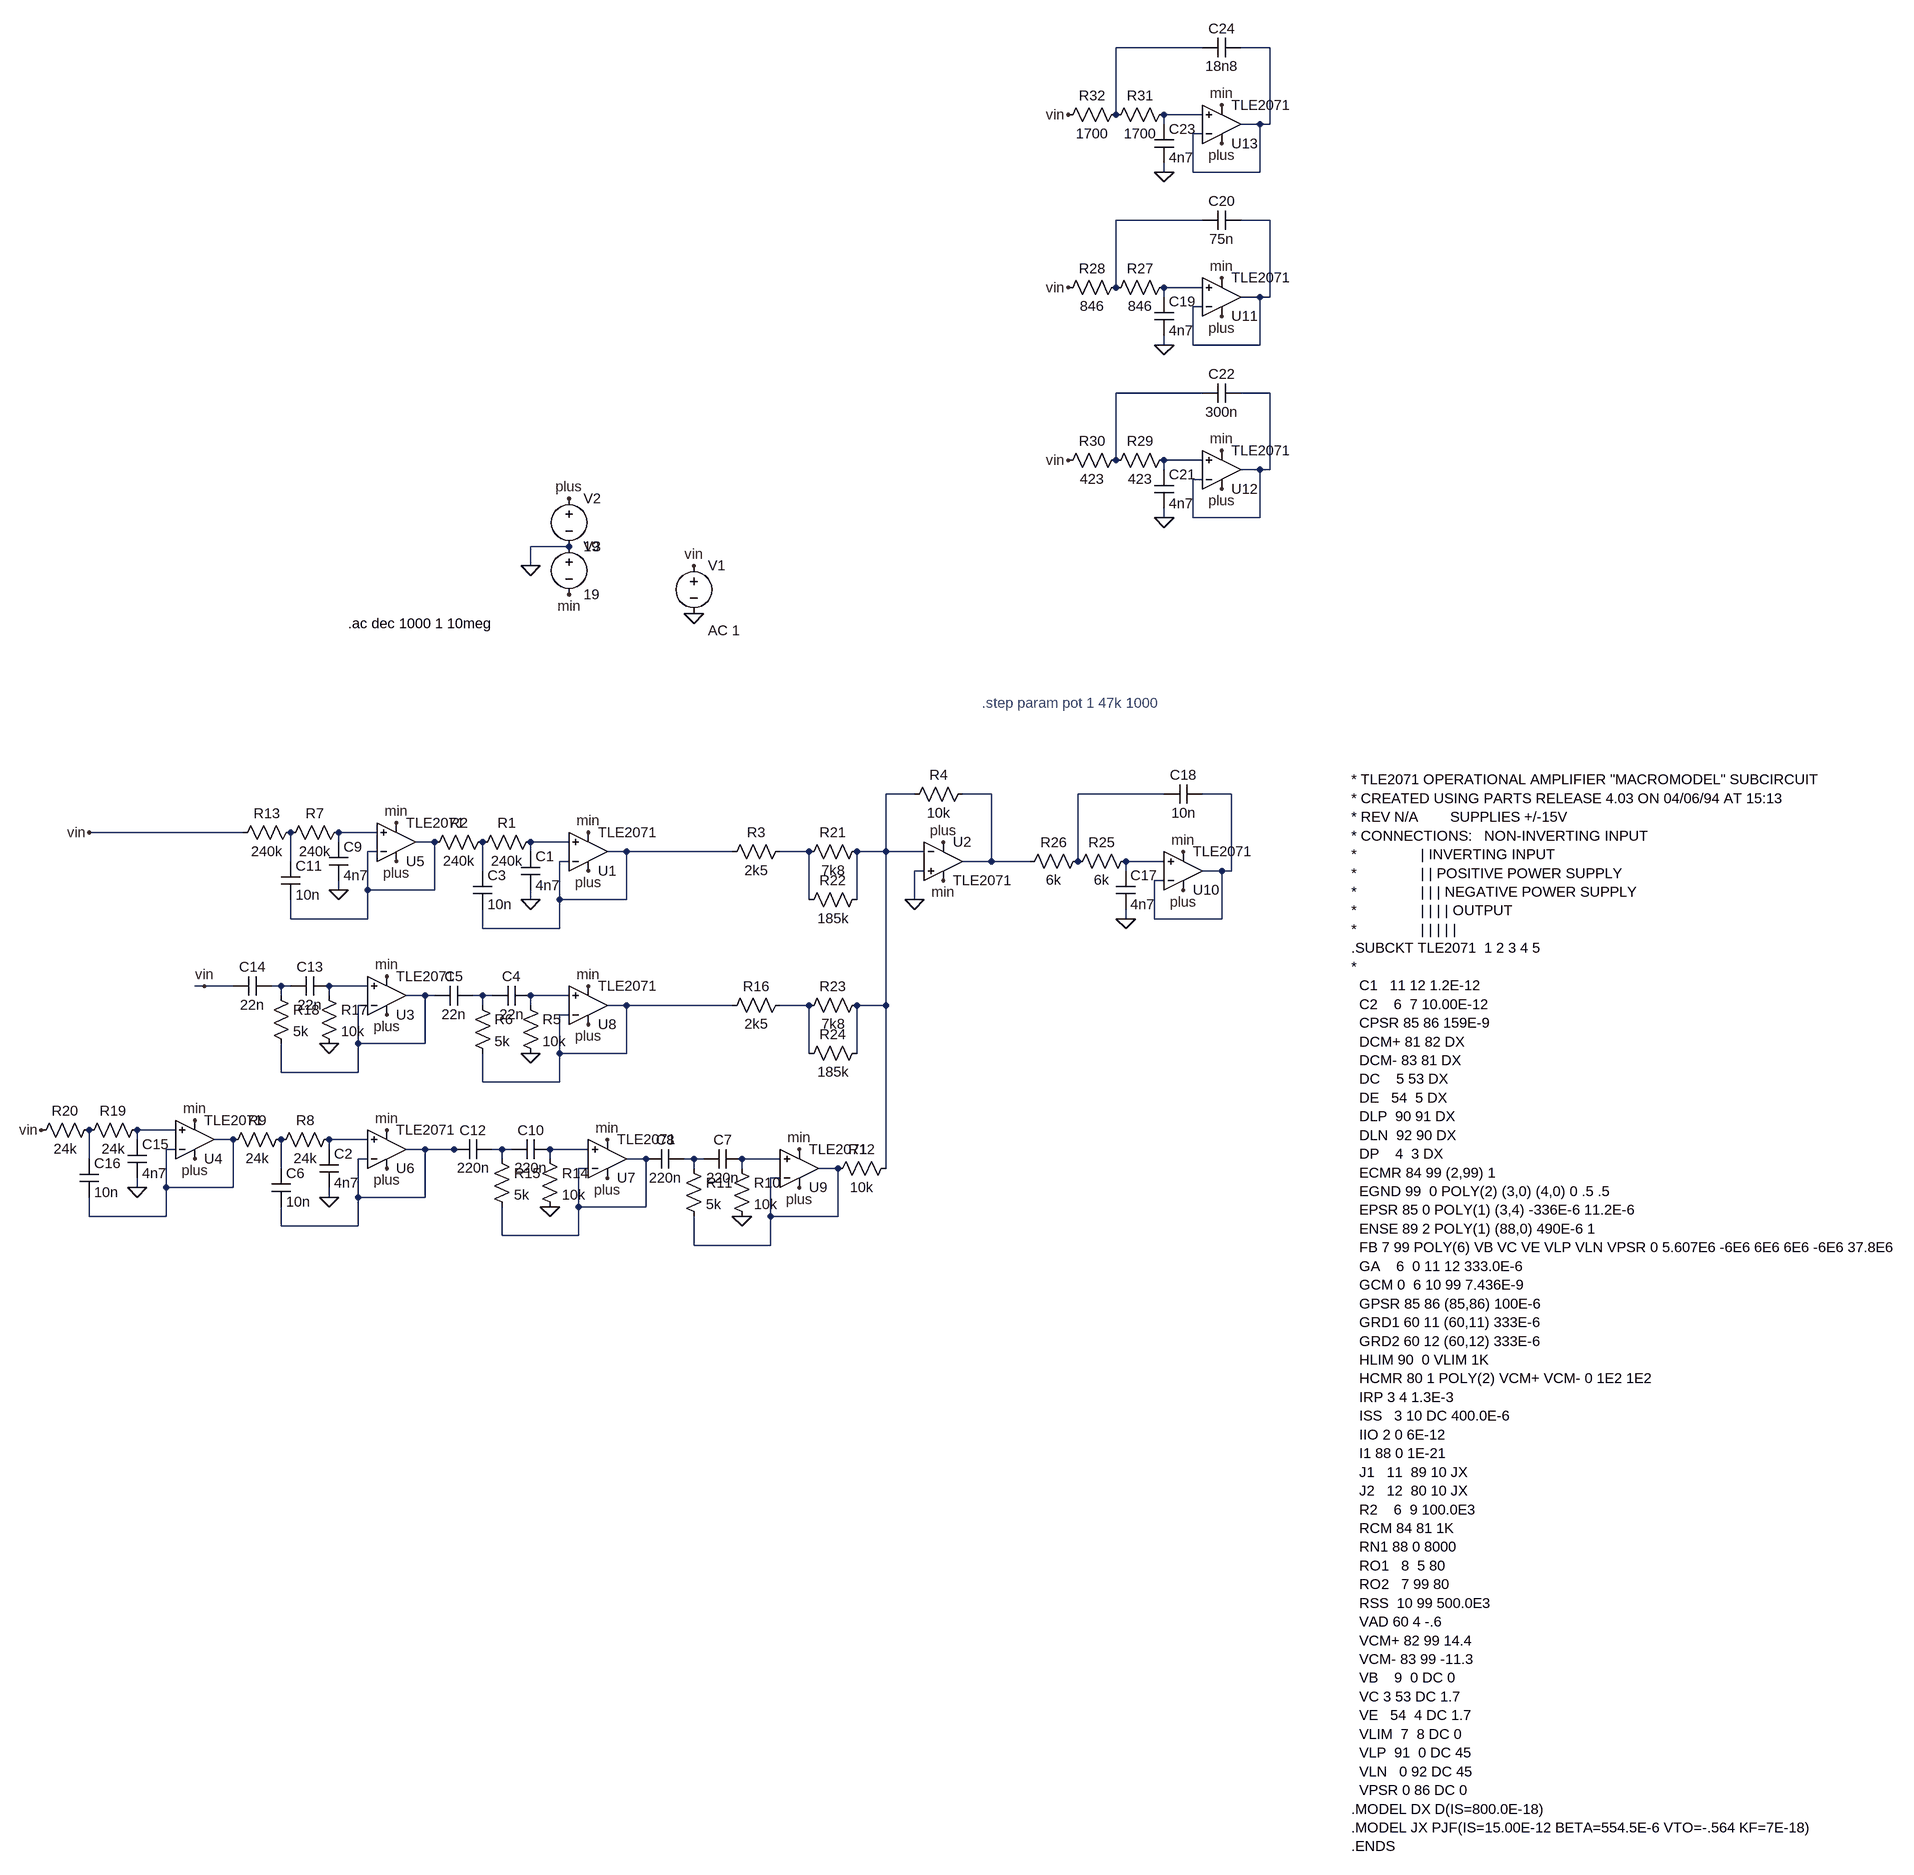
[diagram p0: schematic linkwitzfilter.asc]
linkwitzfilter.asc, the LTspice schematic file:
Version 4.1
SHEET 1 2772 1664
WIRE 1248 -1200 1104 -1200
WIRE 1360 -1200 1312 -1200
WIRE 1104 -1088 1104 -1200
WIRE 1248 -1088 1184 -1088
WIRE 1184 -1072 1184 -1088
WIRE 1344 -1072 1312 -1072
WIRE 1360 -1072 1360 -1200
WIRE 1360 -1072 1344 -1072
WIRE 1248 -1056 1232 -1056
WIRE 1184 -992 1184 -1008
WIRE 1232 -992 1232 -1056
WIRE 1344 -992 1344 -1072
WIRE 1344 -992 1232 -992
WIRE 1248 -912 1104 -912
WIRE 1360 -912 1312 -912
WIRE 1104 -800 1104 -912
WIRE 1248 -800 1184 -800
WIRE 1184 -784 1184 -800
WIRE 1344 -784 1312 -784
WIRE 1360 -784 1360 -912
WIRE 1360 -784 1344 -784
WIRE 1248 -768 1232 -768
WIRE 1184 -704 1184 -720
WIRE 1232 -704 1232 -768
WIRE 1344 -704 1344 -784
WIRE 1344 -704 1232 -704
WIRE 1248 -624 1104 -624
WIRE 1360 -624 1312 -624
WIRE 1104 -512 1104 -624
WIRE 1248 -512 1184 -512
WIRE 1184 -496 1184 -512
WIRE 1344 -496 1312 -496
WIRE 1360 -496 1360 -624
WIRE 1360 -496 1344 -496
WIRE 1248 -480 1232 -480
WIRE 1184 -416 1184 -432
WIRE 1232 -416 1232 -480
WIRE 1344 -416 1344 -496
WIRE 1344 -416 1232 -416
WIRE 192 -368 128 -368
WIRE 128 -336 128 -368
WIRE 768 48 720 48
WIRE 896 48 848 48
WIRE 1184 48 1040 48
WIRE 1296 48 1248 48
WIRE -352 112 -608 112
WIRE -128 112 -192 112
WIRE -192 128 -192 112
WIRE -32 128 -64 128
WIRE 192 128 128 128
WIRE -128 144 -144 144
WIRE 128 144 128 128
WIRE 288 144 256 144
WIRE 464 144 288 144
WIRE 592 144 544 144
WIRE 720 144 720 48
WIRE 720 144 672 144
WIRE 784 144 720 144
WIRE -272 160 -272 112
WIRE 192 160 176 160
WIRE 896 160 896 48
WIRE 896 160 848 160
WIRE 960 160 896 160
WIRE 1040 160 1040 48
WIRE 1184 160 1120 160
WIRE 48 176 48 128
WIRE 784 176 768 176
WIRE 1120 176 1120 160
WIRE 1280 176 1248 176
WIRE 1296 176 1296 48
WIRE 1296 176 1280 176
WIRE 1184 192 1168 192
WIRE -192 208 -192 192
WIRE -144 208 -144 144
WIRE -32 208 -32 128
WIRE -32 208 -144 208
WIRE 128 224 128 208
WIRE 176 224 176 160
WIRE 288 224 288 144
WIRE 288 224 176 224
WIRE 592 224 592 144
WIRE 672 224 672 144
WIRE 768 224 768 176
WIRE -272 256 -272 224
WIRE -144 256 -144 208
WIRE -144 256 -272 256
WIRE 1120 256 1120 240
WIRE 1168 256 1168 192
WIRE 1280 256 1280 176
WIRE 1280 256 1168 256
WIRE 48 272 48 240
WIRE 176 272 176 224
WIRE 176 272 48 272
WIRE -416 368 -432 368
WIRE -368 368 -416 368
WIRE -288 368 -304 368
WIRE -272 368 -288 368
WIRE -144 368 -208 368
WIRE -288 384 -288 368
WIRE -208 384 -208 368
WIRE -48 384 -80 384
WIRE -32 384 -48 384
WIRE 48 384 32 384
WIRE 64 384 48 384
WIRE 192 384 128 384
WIRE -144 400 -160 400
WIRE 48 400 48 384
WIRE 128 400 128 384
WIRE 288 400 256 400
WIRE 464 400 288 400
WIRE 592 400 544 400
WIRE 720 400 720 144
WIRE 720 400 672 400
WIRE 192 416 176 416
WIRE -160 464 -160 400
WIRE -48 464 -48 384
WIRE -48 464 -160 464
WIRE 176 480 176 416
WIRE 288 480 288 400
WIRE 288 480 176 480
WIRE 592 480 592 400
WIRE 672 480 672 400
WIRE -288 512 -288 464
WIRE -160 512 -160 464
WIRE -160 512 -288 512
WIRE 48 528 48 480
WIRE 176 528 176 480
WIRE 176 528 48 528
WIRE -464 608 -528 608
WIRE -528 624 -528 608
WIRE -368 624 -400 624
WIRE -144 624 -208 624
WIRE -464 640 -480 640
WIRE -208 640 -208 624
WIRE -48 640 -80 640
WIRE 0 640 -48 640
WIRE 16 640 0 640
WIRE 80 640 64 640
WIRE 96 640 80 640
WIRE 224 640 160 640
WIRE -608 656 -608 608
WIRE -144 656 -160 656
WIRE 80 656 80 640
WIRE 160 656 160 640
WIRE 320 656 288 656
WIRE 400 656 384 656
WIRE 416 656 400 656
WIRE 544 656 480 656
WIRE -288 672 -288 624
WIRE 224 672 208 672
WIRE 400 672 400 656
WIRE 480 672 480 656
WIRE 640 672 608 672
WIRE 720 672 720 400
WIRE 544 688 528 688
WIRE -528 704 -528 688
WIRE -480 704 -480 640
WIRE -368 704 -368 624
WIRE -368 704 -480 704
WIRE -208 720 -208 704
WIRE -160 720 -160 656
WIRE -48 720 -48 640
WIRE -48 720 -160 720
WIRE 208 736 208 672
WIRE 320 736 320 656
WIRE 320 736 208 736
WIRE -608 752 -608 720
WIRE -480 752 -480 704
WIRE -480 752 -608 752
WIRE 528 752 528 688
WIRE 640 752 640 672
WIRE 640 752 528 752
WIRE -288 768 -288 736
WIRE -160 768 -160 720
WIRE -160 768 -288 768
WIRE 80 784 80 736
WIRE 208 784 208 736
WIRE 208 784 80 784
WIRE 400 800 400 752
WIRE 528 800 528 752
WIRE 528 800 400 800
FLAG 400 -256 0
FLAG 128 -336 0
FLAG 192 -288 min
FLAG 192 -448 plus
FLAG 128 224 0
FLAG 768 224 0
FLAG 816 128 plus
FLAG 816 192 min
FLAG 224 368 min
FLAG 224 432 plus
FLAG 128 480 0
FLAG 400 -336 vin
FLAG -416 368 vin
FLAG -112 608 min
FLAG -112 672 plus
FLAG -208 720 0
FLAG 576 640 min
FLAG 576 704 plus
FLAG 480 752 0
FLAG -688 608 vin
FLAG -608 112 vin
FLAG 224 112 min
FLAG 224 176 plus
FLAG -192 208 0
FLAG -96 96 min
FLAG -96 160 plus
FLAG 256 624 min
FLAG 256 688 plus
FLAG 160 736 0
FLAG -112 352 min
FLAG -112 416 plus
FLAG -208 464 0
FLAG -432 592 min
FLAG -432 656 plus
FLAG -528 704 0
FLAG 1120 256 0
FLAG 1216 144 min
FLAG 1216 208 plus
FLAG 1184 -704 0
FLAG 1280 -816 min
FLAG 1280 -752 plus
FLAG 1024 -800 vin
FLAG 1184 -416 0
FLAG 1280 -528 min
FLAG 1280 -464 plus
FLAG 1024 -512 vin
FLAG 1184 -992 0
FLAG 1280 -1104 min
FLAG 1280 -1040 plus
FLAG 1024 -1088 vin
SYMBOL cap 112 144 R0
SYMATTR InstName C1
SYMATTR Value 4n7
SYMBOL res 144 112 R90
WINDOW 0 0 56 VBottom 2
WINDOW 3 32 56 VTop 2
SYMATTR InstName R1
SYMATTR Value 240k
SYMBOL res 64 112 R90
WINDOW 0 0 56 VBottom 2
WINDOW 3 32 56 VTop 2
SYMATTR InstName R2
SYMATTR Value 240k
SYMBOL voltage 400 -352 R0
WINDOW 123 24 124 Left 2
WINDOW 39 0 0 Left 0
SYMATTR Value2 AC 1
SYMATTR InstName V1
SYMATTR Value ""
SYMBOL voltage 192 -464 R0
WINDOW 123 0 0 Left 0
WINDOW 39 0 0 Left 0
SYMATTR InstName V2
SYMATTR Value 19
SYMBOL voltage 192 -384 R0
WINDOW 123 0 0 Left 0
WINDOW 39 0 0 Left 0
SYMATTR InstName V3
SYMATTR Value 19
SYMBOL cap 32 176 R0
SYMATTR InstName C3
SYMATTR Value 10n
SYMBOL res 560 128 R90
WINDOW 0 0 56 VBottom 2
WINDOW 3 32 56 VTop 2
SYMATTR InstName R3
SYMATTR Value 2k5
SYMBOL res 864 32 R90
WINDOW 0 0 56 VBottom 2
WINDOW 3 32 56 VTop 2
SYMATTR InstName R4
SYMATTR Value 10k
SYMBOL res 112 384 R0
SYMATTR InstName R5
SYMATTR Value 10k
SYMBOL res 32 384 R0
SYMATTR InstName R6
SYMATTR Value 5k
SYMBOL cap 128 368 R90
WINDOW 0 0 32 VBottom 2
WINDOW 3 32 32 VTop 2
SYMATTR InstName C4
SYMATTR Value 22n
SYMBOL cap 32 368 R90
WINDOW 0 0 32 VBottom 2
WINDOW 3 32 32 VTop 2
SYMATTR InstName C5
SYMATTR Value 22n
SYMBOL cap -224 640 R0
SYMATTR InstName C2
SYMATTR Value 4n7
SYMBOL res -192 608 R90
WINDOW 0 0 56 VBottom 2
WINDOW 3 32 56 VTop 2
SYMATTR InstName R8
SYMATTR Value 24k
SYMBOL res -272 608 R90
WINDOW 0 0 56 VBottom 2
WINDOW 3 32 56 VTop 2
SYMATTR InstName R9
SYMATTR Value 24k
SYMBOL cap -304 672 R0
SYMATTR InstName C6
SYMATTR Value 10n
SYMBOL res 464 656 R0
SYMATTR InstName R10
SYMATTR Value 10k
SYMBOL res 384 656 R0
SYMATTR InstName R11
SYMATTR Value 5k
SYMBOL cap 480 640 R90
WINDOW 0 0 32 VBottom 2
WINDOW 3 32 32 VTop 2
SYMATTR InstName C7
SYMATTR Value 220n
SYMBOL cap 384 640 R90
WINDOW 0 0 32 VBottom 2
WINDOW 3 32 32 VTop 2
SYMATTR InstName C8
SYMATTR Value 220n
SYMBOL res 736 656 R90
WINDOW 0 0 56 VBottom 2
WINDOW 3 32 56 VTop 2
SYMATTR InstName R12
SYMATTR Value 10k
SYMBOL cap -208 128 R0
SYMATTR InstName C9
SYMATTR Value 4n7
SYMBOL res -176 96 R90
WINDOW 0 0 56 VBottom 2
WINDOW 3 32 56 VTop 2
SYMATTR InstName R7
SYMATTR Value 240k
SYMBOL res -256 96 R90
WINDOW 0 0 56 VBottom 2
WINDOW 3 32 56 VTop 2
SYMATTR InstName R13
SYMATTR Value 240k
SYMBOL cap -288 160 R0
SYMATTR InstName C11
SYMATTR Value 10n
SYMBOL res 144 640 R0
SYMATTR InstName R14
SYMATTR Value 10k
SYMBOL res 64 640 R0
SYMATTR InstName R15
SYMATTR Value 5k
SYMBOL cap 160 624 R90
WINDOW 0 0 32 VBottom 2
WINDOW 3 32 32 VTop 2
SYMATTR InstName C10
SYMATTR Value 220n
SYMBOL cap 64 624 R90
WINDOW 0 0 32 VBottom 2
WINDOW 3 32 32 VTop 2
SYMATTR InstName C12
SYMATTR Value 220n
SYMBOL res -224 368 R0
SYMATTR InstName R17
SYMATTR Value 10k
SYMBOL res -304 368 R0
SYMATTR InstName R18
SYMATTR Value 5k
SYMBOL cap -208 352 R90
WINDOW 0 0 32 VBottom 2
WINDOW 3 32 32 VTop 2
SYMATTR InstName C13
SYMATTR Value 22n
SYMBOL cap -304 352 R90
WINDOW 0 0 32 VBottom 2
WINDOW 3 32 32 VTop 2
SYMATTR InstName C14
SYMATTR Value 22n
SYMBOL cap -544 624 R0
SYMATTR InstName C15
SYMATTR Value 4n7
SYMBOL res -512 592 R90
WINDOW 0 0 56 VBottom 2
WINDOW 3 32 56 VTop 2
SYMATTR InstName R19
SYMATTR Value 24k
SYMBOL res -592 592 R90
WINDOW 0 0 56 VBottom 2
WINDOW 3 32 56 VTop 2
SYMATTR InstName R20
SYMATTR Value 24k
SYMBOL cap -624 656 R0
SYMATTR InstName C16
SYMATTR Value 10n
SYMBOL res 688 128 R90
WINDOW 0 0 56 VBottom 2
WINDOW 3 32 56 VTop 2
SYMATTR InstName R21
SYMATTR Value 7k8
SYMBOL res 688 208 R90
WINDOW 0 0 56 VBottom 2
WINDOW 3 32 56 VTop 2
SYMATTR InstName R22
SYMATTR Value 185k
SYMBOL res 560 384 R90
WINDOW 0 0 56 VBottom 2
WINDOW 3 32 56 VTop 2
SYMATTR InstName R16
SYMATTR Value 2k5
SYMBOL res 688 384 R90
WINDOW 0 0 56 VBottom 2
WINDOW 3 32 56 VTop 2
SYMATTR InstName R23
SYMATTR Value 7k8
SYMBOL res 688 464 R90
WINDOW 0 0 56 VBottom 2
WINDOW 3 32 56 VTop 2
SYMATTR InstName R24
SYMATTR Value 185k
SYMBOL cap 1104 176 R0
SYMATTR InstName C17
SYMATTR Value 4n7
SYMBOL res 1136 144 R90
WINDOW 0 0 56 VBottom 2
WINDOW 3 32 56 VTop 2
SYMATTR InstName R25
SYMATTR Value 6k
SYMBOL res 1056 144 R90
WINDOW 0 0 56 VBottom 2
WINDOW 3 32 56 VTop 2
SYMATTR InstName R26
SYMATTR Value 6k
SYMBOL cap 1248 32 R90
WINDOW 0 0 32 VBottom 2
WINDOW 3 32 32 VTop 2
SYMATTR InstName C18
SYMATTR Value 10n
SYMBOL OpAmps\\opamp2 1216 240 M180
SYMATTR InstName U10
SYMATTR Value TLE2071
SYMBOL OpAmps\\opamp2 816 96 R0
SYMATTR InstName U2
SYMATTR Value TLE2071
SYMBOL OpAmps\\opamp2 224 208 M180
SYMATTR InstName U1
SYMATTR Value TLE2071
SYMBOL OpAmps\\opamp2 -96 192 M180
SYMATTR InstName U5
SYMATTR Value TLE2071
SYMBOL OpAmps\\opamp2 -112 448 M180
SYMATTR InstName U3
SYMATTR Value TLE2071
SYMBOL OpAmps\\opamp2 224 464 M180
SYMATTR InstName U8
SYMATTR Value TLE2071
SYMBOL OpAmps\\opamp2 -432 688 M180
SYMATTR InstName U4
SYMATTR Value TLE2071
SYMBOL OpAmps\\opamp2 -112 704 M180
SYMATTR InstName U6
SYMATTR Value TLE2071
SYMBOL OpAmps\\opamp2 256 720 M180
SYMATTR InstName U7
SYMATTR Value TLE2071
SYMBOL OpAmps\\opamp2 576 736 M180
SYMATTR InstName U9
SYMATTR Value TLE2071
SYMBOL cap 1168 -784 R0
SYMATTR InstName C19
SYMATTR Value 4n7
SYMBOL res 1200 -816 R90
WINDOW 0 0 56 VBottom 2
WINDOW 3 32 56 VTop 2
SYMATTR InstName R27
SYMATTR Value 846
SYMBOL res 1120 -816 R90
WINDOW 0 0 56 VBottom 2
WINDOW 3 32 56 VTop 2
SYMATTR InstName R28
SYMATTR Value 846
SYMBOL cap 1312 -928 R90
WINDOW 0 0 32 VBottom 2
WINDOW 3 32 32 VTop 2
SYMATTR InstName C20
SYMATTR Value 75n
SYMBOL OpAmps\\opamp2 1280 -720 M180
SYMATTR InstName U11
SYMATTR Value TLE2071
SYMBOL cap 1168 -496 R0
SYMATTR InstName C21
SYMATTR Value 4n7
SYMBOL res 1200 -528 R90
WINDOW 0 0 56 VBottom 2
WINDOW 3 32 56 VTop 2
SYMATTR InstName R29
SYMATTR Value 423
SYMBOL res 1120 -528 R90
WINDOW 0 0 56 VBottom 2
WINDOW 3 32 56 VTop 2
SYMATTR InstName R30
SYMATTR Value 423
SYMBOL cap 1312 -640 R90
WINDOW 0 0 32 VBottom 2
WINDOW 3 32 32 VTop 2
SYMATTR InstName C22
SYMATTR Value 300n
SYMBOL OpAmps\\opamp2 1280 -432 M180
SYMATTR InstName U12
SYMATTR Value TLE2071
SYMBOL cap 1168 -1072 R0
SYMATTR InstName C23
SYMATTR Value 4n7
SYMBOL res 1200 -1104 R90
WINDOW 0 0 56 VBottom 2
WINDOW 3 32 56 VTop 2
SYMATTR InstName R31
SYMATTR Value 1700
SYMBOL res 1120 -1104 R90
WINDOW 0 0 56 VBottom 2
WINDOW 3 32 56 VTop 2
SYMATTR InstName R32
SYMATTR Value 1700
SYMBOL cap 1312 -1216 R90
WINDOW 0 0 32 VBottom 2
WINDOW 3 32 32 VTop 2
SYMATTR InstName C24
SYMATTR Value 18n8
SYMBOL OpAmps\\opamp2 1280 -1008 M180
SYMATTR InstName U13
SYMATTR Value TLE2071
TEXT -176 -240 Left 2 !.ac dec 1000 1 10meg
TEXT 880 -104 Left 2 ;.step param pot 1 47k 1000
TEXT 1848 24 Left 2 !* TLE2071 OPERATIONAL AMPLIFIER "MACROMODEL" SUBCIRCUIT\n* CREATED USING PARTS RELEASE 4.03 ON 04/06/94 AT 15:13\n* REV N/A        SUPPLIES +/-15V\n* CONNECTIONS:   NON-INVERTING INPUT\n*                | INVERTING INPUT\n*                | | POSITIVE POWER SUPPLY\n*                | | | NEGATIVE POWER SUPPLY\n*                | | | | OUTPUT\n*                | | | | |\n.SUBCKT TLE2071  1 2 3 4 5\n*\n  C1   11 12 1.2E-12\n  C2    6  7 10.00E-12\n  CPSR 85 86 159E-9\n  DCM+ 81 82 DX\n  DCM- 83 81 DX\n  DC    5 53 DX\n  DE   54  5 DX\n  DLP  90 91 DX\n  DLN  92 90 DX\n  DP    4  3 DX\n  ECMR 84 99 (2,99) 1\n  EGND 99  0 POLY(2) (3,0) (4,0) 0 .5 .5\n  EPSR 85 0 POLY(1) (3,4) -336E-6 11.2E-6\n  ENSE 89 2 POLY(1) (88,0) 490E-6 1\n  FB 7 99 POLY(6) VB VC VE VLP VLN VPSR 0 5.607E6 -6E6 6E6 6E6 -6E6 37.8E6\n  GA    6  0 11 12 333.0E-6\n  GCM 0  6 10 99 7.436E-9\n  GPSR 85 86 (85,86) 100E-6\n  GRD1 60 11 (60,11) 333E-6\n  GRD2 60 12 (60,12) 333E-6\n  HLIM 90  0 VLIM 1K\n  HCMR 80 1 POLY(2) VCM+ VCM- 0 1E2 1E2\n  IRP 3 4 1.3E-3\n  ISS   3 10 DC 400.0E-6\n  IIO 2 0 6E-12\n  I1 88 0 1E-21\n  J1   11  89 10 JX\n  J2   12  80 10 JX\n  R2    6  9 100.0E3\n  RCM 84 81 1K\n  RN1 88 0 8000\n  RO1   8  5 80\n  RO2   7 99 80\n  RSS  10 99 500.0E3\n  VAD 60 4 -.6\n  VCM+ 82 99 14.4\n  VCM- 83 99 -11.3\n  VB    9  0 DC 0\n  VC 3 53 DC 1.7\n  VE   54  4 DC 1.7\n  VLIM  7  8 DC 0\n  VLP  91  0 DC 45\n  VLN   0 92 DC 45\n  VPSR 0 86 DC 0\n.MODEL DX D(IS=800.0E-18)\n.MODEL JX PJF(IS=15.00E-12 BETA=554.5E-6 VTO=-.564 KF=7E-18)\n.ENDS

The netlist it stands for:
* linkwitzfilter.asc
C1 N016 0 4n7
R1 N016 N021 240k
R2 N021 N015 240k
V1 vin 0 AC 1
V2 plus 0 19
V3 0 min 19
C3 N021 N017 10n
R3 N018 N017 2k5
R4 N011 N010 10k
R5 N026 0 10k
R6 N025 N027 5k
C4 N026 N025 22n
C5 N025 N024 22n
C2 N031 0 4n7
R8 N031 N039 24k
R9 N039 N030 24k
C6 N039 N032 10n
R10 N038 0 10k
R11 N037 N040 5k
C7 N038 N037 220n
C8 N037 N036 220n
R12 N010 N040 10k
C9 N014 0 4n7
R7 N014 N019 240k
R13 N019 vin 240k
C11 N019 N015 10n
R14 N034 0 10k
R15 N033 N036 5k
C10 N034 N033 220n
C12 N033 N032 220n
R17 N023 0 10k
R18 N022 N024 5k
C13 N023 N022 22n
C14 N022 vin 22n
C15 N029 0 4n7
R19 N029 N035 24k
R20 N035 vin 24k
C16 N035 N030 10n
R21 N010 N018 7k8
R22 N010 N018 185k
R16 N028 N027 2k5
R23 N010 N028 7k8
R24 N010 N028 185k
C17 N020 0 4n7
R25 N020 N012 6k
R26 N012 N011 6k
C18 N013 N012 10n
X§U10 N020 N013 plus min N013 TLE2071  ; pins In+ In- V+ V- OUT
X§U2 0 N010 plus min N011 TLE2071  ; pins In+ In- V+ V- OUT
X§U1 N016 N017 plus min N017 TLE2071  ; pins In+ In- V+ V- OUT
X§U5 N014 N015 plus min N015 TLE2071  ; pins In+ In- V+ V- OUT
X§U3 N023 N024 plus min N024 TLE2071  ; pins In+ In- V+ V- OUT
X§U8 N026 N027 plus min N027 TLE2071  ; pins In+ In- V+ V- OUT
X§U4 N029 N030 plus min N030 TLE2071  ; pins In+ In- V+ V- OUT
X§U6 N031 N032 plus min N032 TLE2071  ; pins In+ In- V+ V- OUT
X§U7 N034 N036 plus min N036 TLE2071  ; pins In+ In- V+ V- OUT
X§U9 N038 N040 plus min N040 TLE2071  ; pins In+ In- V+ V- OUT
C19 N006 0 4n7
R27 N006 N004 846
R28 N004 vin 846
C20 N005 N004 75n
X§U11 N006 N005 plus min N005 TLE2071  ; pins In+ In- V+ V- OUT
C21 N009 0 4n7
R29 N009 N007 423
R30 N007 vin 423
C22 N008 N007 300n
X§U12 N009 N008 plus min N008 TLE2071  ; pins In+ In- V+ V- OUT
C23 N003 0 4n7
R31 N003 N001 1700
R32 N001 vin 1700
C24 N002 N001 18n8
X§U13 N003 N002 plus min N002 TLE2071  ; pins In+ In- V+ V- OUT
.ac dec 1000 1 10meg
* .step param pot 1 47k 1000
* TLE2071 OPERATIONAL AMPLIFIER "MACROMODEL" SUBCIRCUIT
* CREATED USING PARTS RELEASE 4.03 ON 04/06/94 AT 15:13
* REV N/A        SUPPLIES +/-15V
* CONNECTIONS:   NON-INVERTING INPUT
*                | INVERTING INPUT
*                | | POSITIVE POWER SUPPLY
*                | | | NEGATIVE POWER SUPPLY
*                | | | | OUTPUT
*                | | | | |
.SUBCKT TLE2071  1 2 3 4 5
*
  C1   11 12 1.2E-12
  C2    6  7 10.00E-12
  CPSR 85 86 159E-9
  DCM+ 81 82 DX
  DCM- 83 81 DX
  DC    5 53 DX
  DE   54  5 DX
  DLP  90 91 DX
  DLN  92 90 DX
  DP    4  3 DX
  ECMR 84 99 (2,99) 1
  EGND 99  0 POLY(2) (3,0) (4,0) 0 .5 .5
  EPSR 85 0 POLY(1) (3,4) -336E-6 11.2E-6
  ENSE 89 2 POLY(1) (88,0) 490E-6 1
  FB 7 99 POLY(6) VB VC VE VLP VLN VPSR 0 5.607E6 -6E6 6E6 6E6 -6E6 37.8E6
  GA    6  0 11 12 333.0E-6
  GCM 0  6 10 99 7.436E-9
  GPSR 85 86 (85,86) 100E-6
  GRD1 60 11 (60,11) 333E-6
  GRD2 60 12 (60,12) 333E-6
  HLIM 90  0 VLIM 1K
  HCMR 80 1 POLY(2) VCM+ VCM- 0 1E2 1E2
  IRP 3 4 1.3E-3
  ISS   3 10 DC 400.0E-6
  IIO 2 0 6E-12
  I1 88 0 1E-21
  J1   11  89 10 JX
  J2   12  80 10 JX
  R2    6  9 100.0E3
  RCM 84 81 1K
  RN1 88 0 8000
  RO1   8  5 80
  RO2   7 99 80
  RSS  10 99 500.0E3
  VAD 60 4 -.6
  VCM+ 82 99 14.4
  VCM- 83 99 -11.3
  VB    9  0 DC 0
  VC 3 53 DC 1.7
  VE   54  4 DC 1.7
  VLIM  7  8 DC 0
  VLP  91  0 DC 45
  VLN   0 92 DC 45
  VPSR 0 86 DC 0
.MODEL DX D(IS=800.0E-18)
.MODEL JX PJF(IS=15.00E-12 BETA=554.5E-6 VTO=-.564 KF=7E-18)
.ENDS
.backanno
.end